# Altium schematic sheet battery_board_v2.SchDoc
size 297 x 209 mm
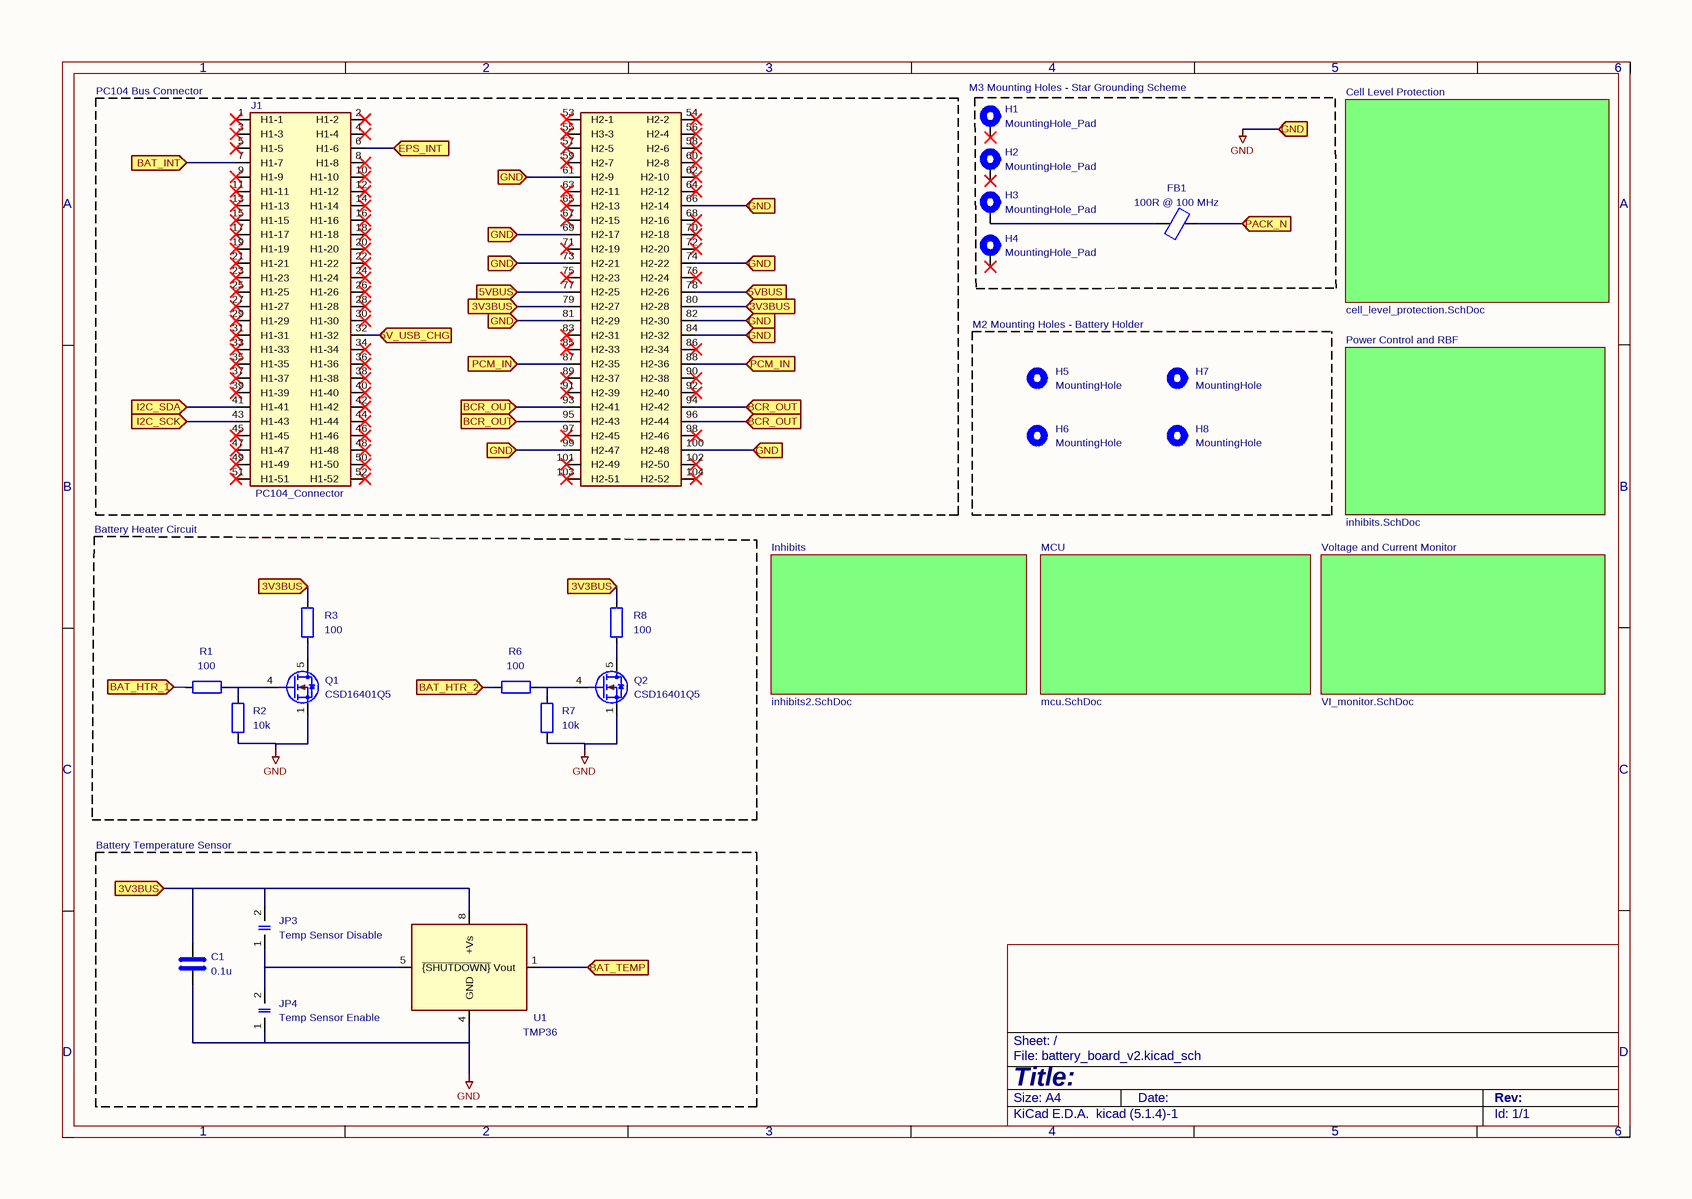
[diagram p0: battery_board_v2.SchDoc]

## Parts
C1  0.1u  [C_0402_1005Metric]
FB1  100R @ 100 MHz  [L_0603_1608Metric]
H1  MountingHole_Pad  [MountingHole_3.2mm_M3_Pad_TopBottom]
H2  MountingHole_Pad  [MountingHole_3.2mm_M3_Pad_TopBottom]
H3  MountingHole_Pad  [MountingHole_3.2mm_M3_Pad_TopBottom]
H4  MountingHole_Pad  [MountingHole_3.2mm_M3_Pad_TopBottom]
H5  MountingHole  [MountingHole_2.2mm_M2_DIN965_Pad]
H6  MountingHole  [MountingHole_2.2mm_M2_DIN965_Pad]
H7  MountingHole  [MountingHole_2.2mm_M2_DIN965_Pad]
H8  MountingHole  [MountingHole_2.2mm_M2_DIN965_Pad]
J1  PC104_Connector  [pc104-connector]
JP3  Temp Sensor Disable  [SolderJumper-2_P1.3mm_Open_Pad1.0x1.5mm]
JP4  Temp Sensor Enable  [SolderJumper-2_P1.3mm_Open_Pad1.0x1.5mm]
Q1  CSD16401Q5  [TDSON-8-1]
Q2  CSD16401Q5  [TDSON-8-1]
R1  100  [R_0402_1005Metric]
R2  10k  [R_0402_1005Metric]
R3  100  [R_Axial_DIN0207_L6.3mm_D2.5mm_P7.62mm_Horizontal]
R6  100  [R_0402_1005Metric]
R7  10k  [R_0402_1005Metric]
R8  100  [R_Axial_DIN0207_L6.3mm_D2.5mm_P7.62mm_Horizontal]
U1  TMP36  [SOIC-8_3.9x4.9mm_P1.27mm]

## Blocks framed on the sheet
PC104 Bus Connector: J1
M2 Mounting Holes - Battery Holder: H5-H8
Battery Temperature Sensor: C1 JP3 JP4 U1

## Sub-sheets
Cell Level Protection = cell_level_protection.SchDoc: no entries
Inhibits = inhibits2.SchDoc: no entries
MCU = mcu.SchDoc: no entries
Power Control and RBF = inhibits.SchDoc: no entries
Voltage and Current Monitor = VI_monitor.SchDoc: no entries

## Ports
3V3BUS (in), 5V_USB_CHG (in), 5VBUS (in), BAT_HTR_1 (in), BAT_HTR_2 (in), BAT_INT (in), BAT_TEMP (in), BCR_OUT (in), EPS_INT (in), GND (in), I2C_SCK (in), I2C_SDA (in), PACK_N (in), PCM_IN (in)

## Nets
GND: C1.2 J1.61(H2-9) J1.66(H2-14) J1.69(H2-17) J1.73(H2-21) J1.74(H2-22) J1.81(H2-29) J1.82(H2-30) J1.84(H2-32) J1.99(H2-47) J1.100(H2-48) JP4.1(A) Q1.1(S) Q2.1(S) R2.1 R7.1 U1.4(GND) ; port GND
3V3BUS: C1.1 J1.79(H2-27) J1.80(H2-28) JP3.2(B) R3.2 R8.2 U1.8(+Vs) ; port 3V3BUS
5V_USB_CHG: J1.32(H1-32) ; port 5V_USB_CHG
5VBUS: J1.77(H2-25) J1.78(H2-26) ; port 5VBUS
BAT_HTR_1: R1.1 ; port BAT_HTR_1
BAT_HTR_2: R6.1 ; port BAT_HTR_2
BAT_INT: J1.7(H1-7) ; port BAT_INT
BAT_TEMP: U1.1(Vout) ; port BAT_TEMP
BCR_OUT: J1.93(H2-41) J1.94(H2-42) J1.95(H2-43) J1.96(H2-44) ; port BCR_OUT
EPS_INT: J1.6(H1-6) ; port EPS_INT
I2C_SCK: J1.43(H1-43) ; port I2C_SCK
I2C_SDA: J1.41(H1-41) ; port I2C_SDA
PACK_N: FB1.2 ; port PACK_N
PCM_IN: J1.87(H2-35) J1.88(H2-36) ; port PCM_IN
NetFB1_1: FB1.1 H3.1
NetJP3_1: JP3.1(A) JP4.2(B) U1.5(~{{SHUTDOWN}})
NetQ1_4: Q1.4(G) R1.2 R2.2
NetQ1_5: Q1.5(D) R3.1
NetQ2_4: Q2.4(G) R6.2 R7.2
NetQ2_5: Q2.5(D) R8.1

Not connected (* = marked no-connect by the designer): H1 1*; H2 1*; H4 1*; J1 1(H1-1)* 2(H1-2)* 3(H1-3)* 4(H1-4)* 5(H1-5)* 8(H1-8)* 9(H1-9)* 10(H1-10)* 11(H1-11)* 12(H1-12)* 13(H1-13)* 14(H1-14)* 15(H1-15)* 16(H1-16)* 17(H1-17)* 18(H1-18)* 19(H1-19)* 20(H1-20)* 21(H1-21)* 22(H1-22)* 23(H1-23)* 24(H1-24)* 25(H1-25)* 26(H1-26)* 27(H1-27)* 28(H1-28)* 29(H1-29)* 30(H1-30)* 31(H1-31)* 33(H1-33)* 34(H1-34)* 35(H1-35)* 36(H1-36)* 37(H1-37)* 38(H1-38)* 39(H1-39)* 40(H1-40)* 42(H1-42)* 44(H1-44)* 45(H1-45)* 46(H1-46)* 47(H1-47)* 48(H1-48)* 49(H1-49)* 50(H1-50)* 51(H1-51)* 52(H1-52)* 53(H2-1)* 54(H2-2)* 55(H3-3)* 56(H2-4)* 57(H2-5)* 58(H2-6)* 59(H2-7)* 60(H2-8)* 62(H2-10)* 63(H2-11)* 64(H2-12)* 65(H2-13)* 67(H2-15)* 68(H2-16)* 70(H2-18)* 71(H2-19)* 72(H2-20)* 75(H2-23)* 76(H2-24)* 83(H2-31)* 85(H2-33)* 86(H2-34)* 89(H2-37)* 90(H2-38)* 91(H2-39)* 92(H2-40)* 97(H2-45)* 98(H2-46)* 101(H2-49)* 102(H2-50)* 103(H2-51)* 104(H2-52)*; Q1 2(S) 3(S); Q2 2(S) 3(S)

## Notes on the sheet
- (near H1) M3 Mounting Holes - Star Grounding Scheme
- Battery Heater Circuit
- 1
- 2
- 3
- 4
- 5
- 6
- A
- B
- C
- D
- Title:
- File: battery_board_v2.kicad_sch
- Sheet: /
- KiCad E.D.A.  kicad (5.1.4)-1
- Size: A4
- Date:
- Rev:
- Id: 1/1

## Library data of the parts
C1 = C: Value: 0.1u; Footprint: Capacitor_SMD:C_0402_1005Metric
FB1 = FerriteBead: Value: 100R @ 100 MHz; Footprint: Inductor_SMD:L_0603_1608Metric
JP3 JP4 = SolderJumper_2_Open: Footprint: Jumper:SolderJumper-2_P1.3mm_Open_Pad1.0x1.5mm
  JP3: Value: Temp Sensor Disable
  JP4: Value: Temp Sensor Enable
R1-R3 R6-R8 = R
  R1 R6: Value: 100; Footprint: Resistor_SMD:R_0402_1005Metric
  R2 R7: Value: 10k; Footprint: Resistor_SMD:R_0402_1005Metric
  R3 R8: Value: 100; Footprint: Resistor_THT:R_Axial_DIN0207_L6.3mm_D2.5mm_P7.62mm_Horizontal
U1 = TMP36xS: Value: TMP36; Footprint: Package_SO:SOIC-8_3.9x4.9mm_P1.27mm
H1-H4 = MountingHole_Pad: Value: MountingHole_Pad; Footprint: MountingHole:MountingHole_3.2mm_M3_Pad_TopBottom
H5-H8 = MountingHole: Value: MountingHole; Footprint: MountingHole:MountingHole_2.2mm_M2_DIN965_Pad
J1 = PC104_Connector: Value: PC104_Connector; Footprint: pc104-template:pc104-connector
Q1 Q2 = CSD16401Q5: Value: CSD16401Q5; Footprint: Package_TO_SOT_SMD:TDSON-8-1